# EasyEDA Pro project sucaiku.epro

# Schematic 01-MCU

## Sheets
1 01-MCU
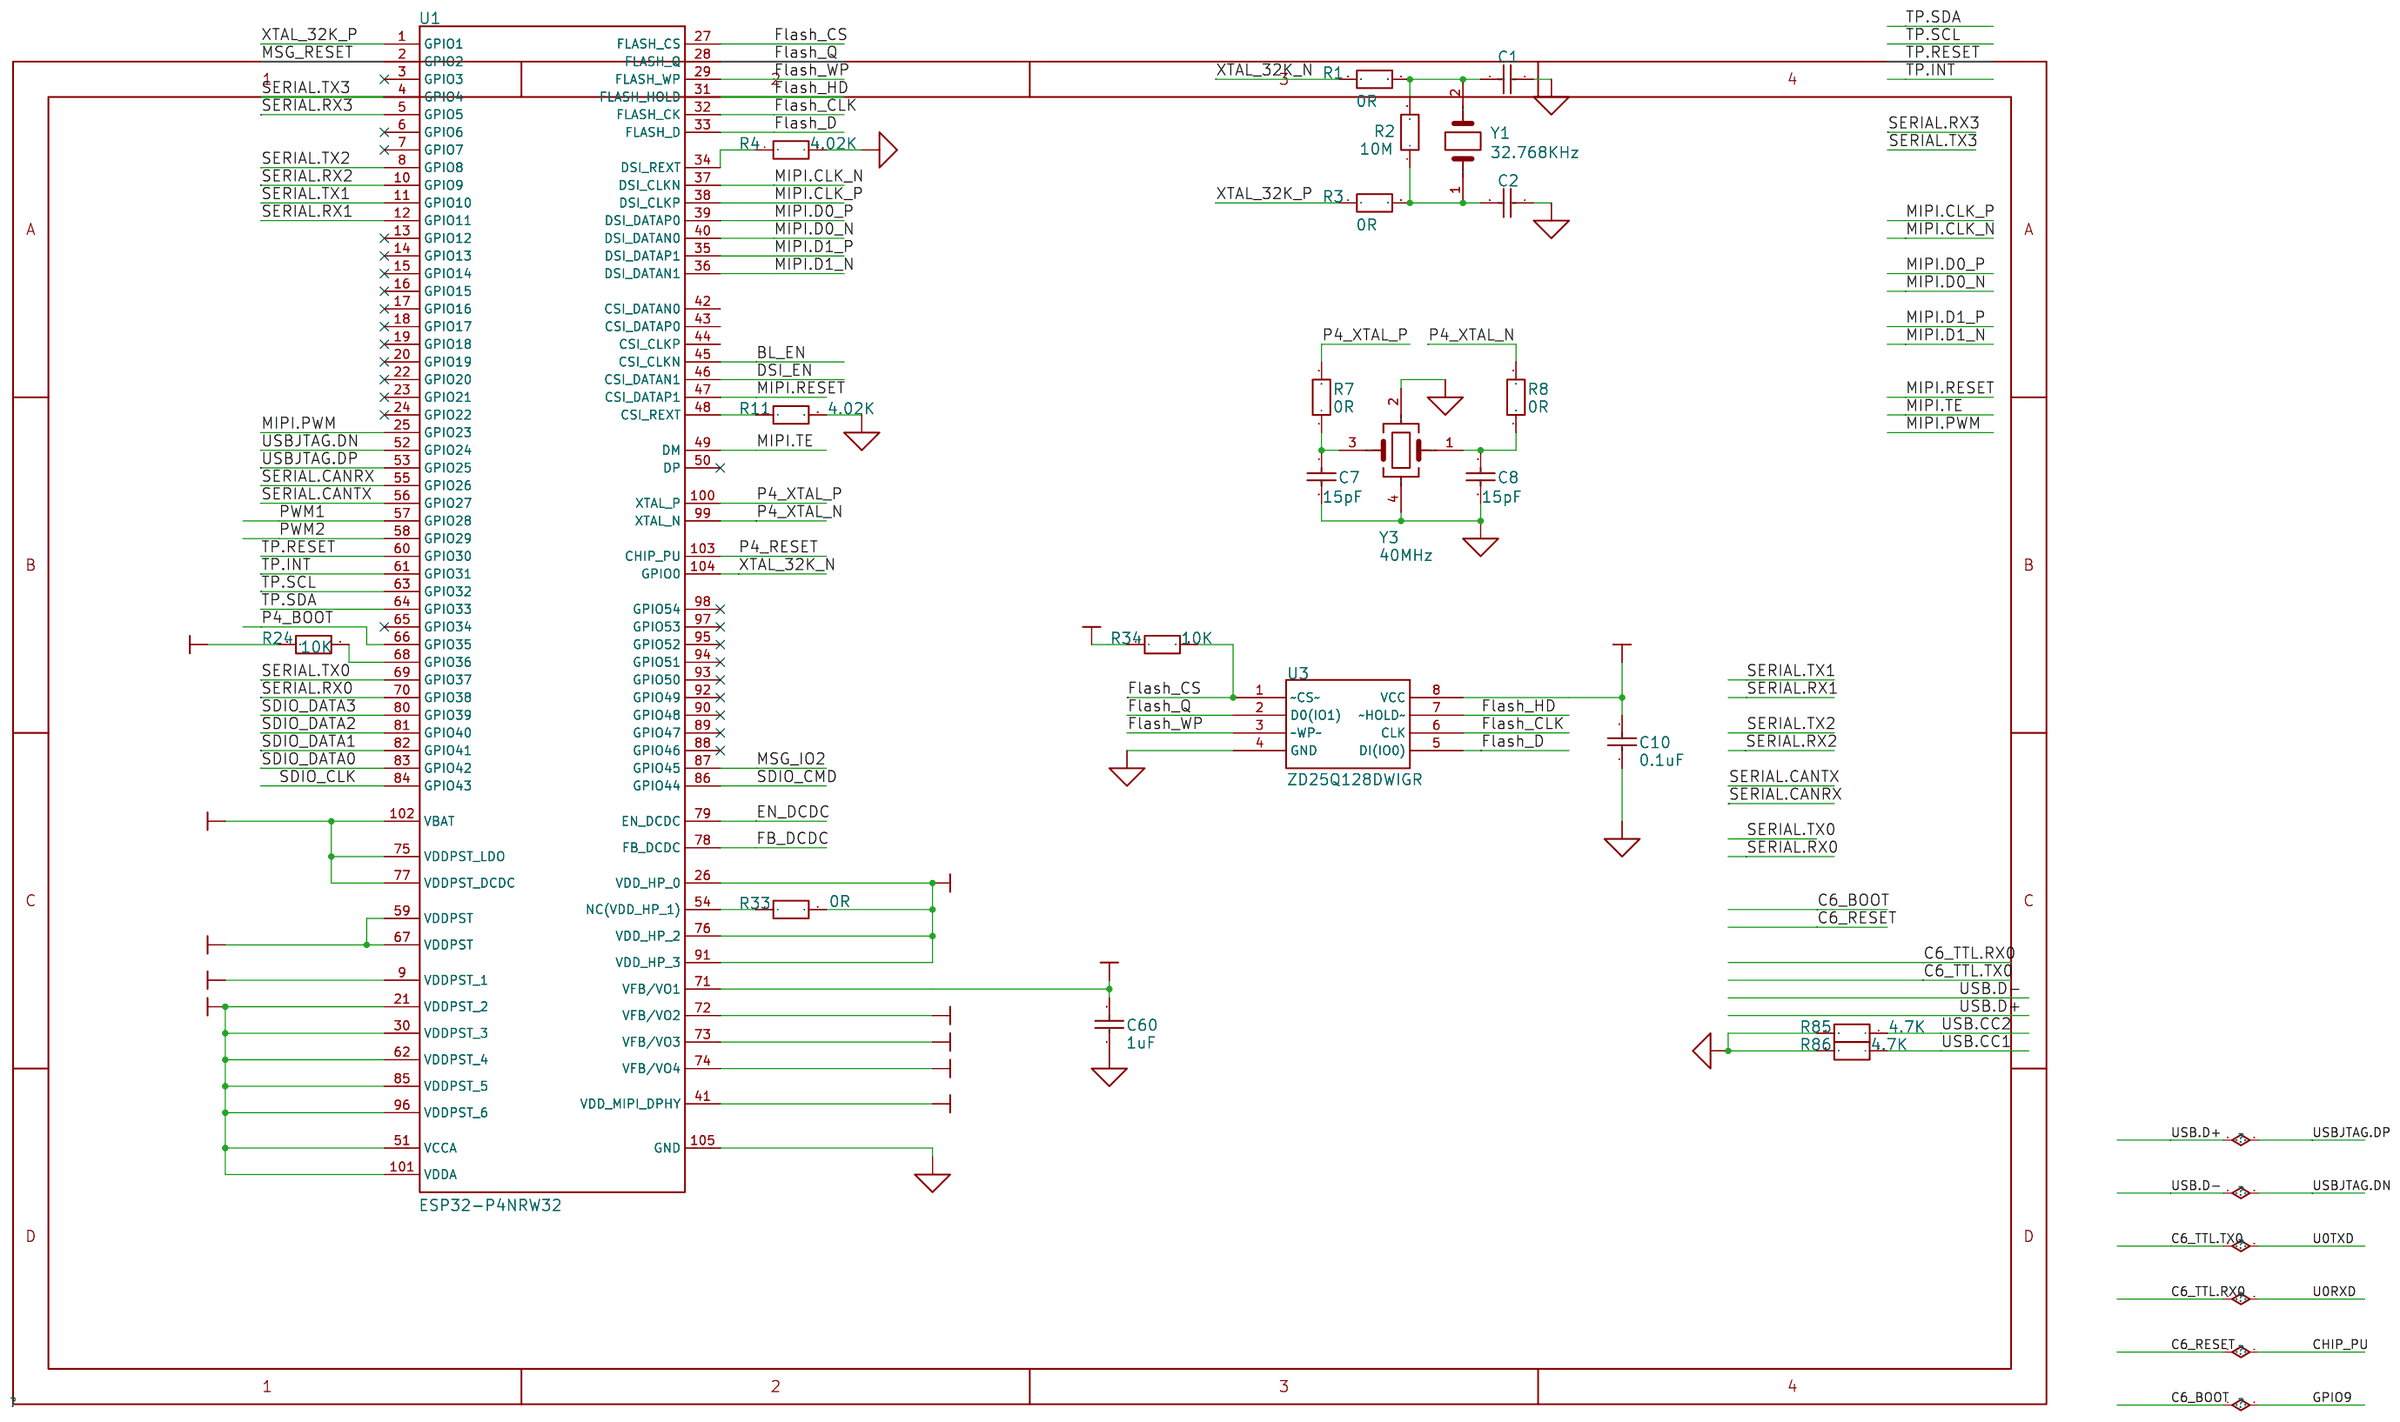
[diagram p0: 01-MCU]
2 02-WIFT+BT
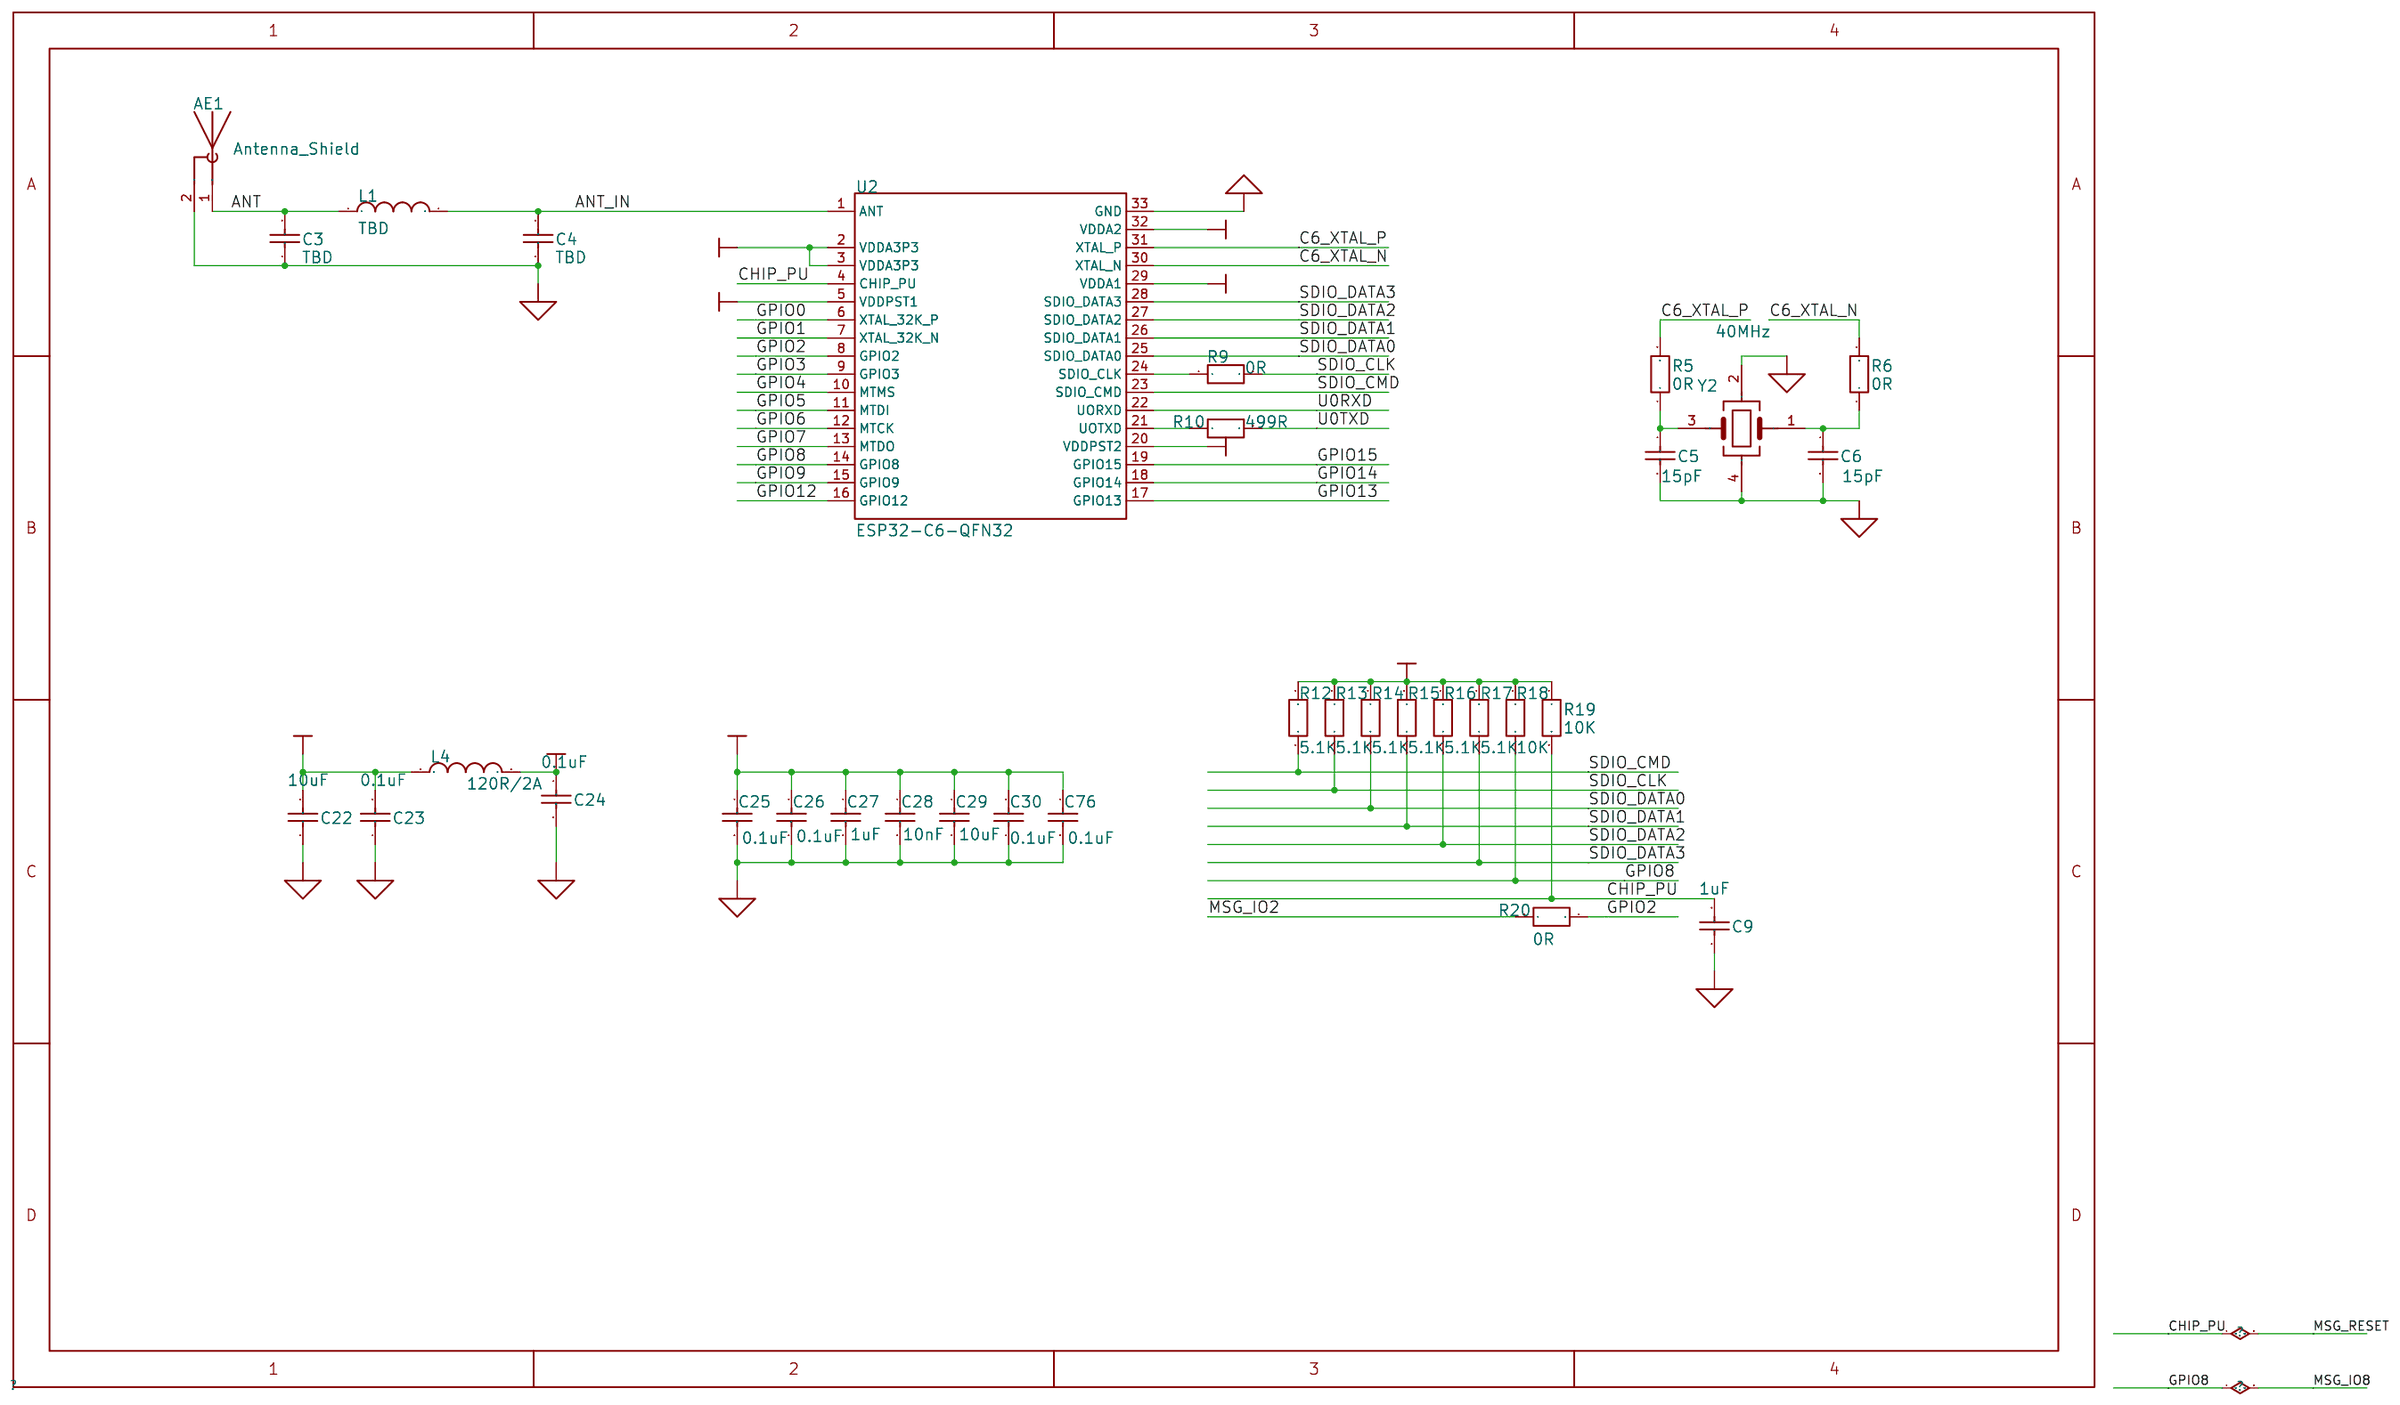
[diagram p1: 02-WIFT+BT]
3 03-POWER
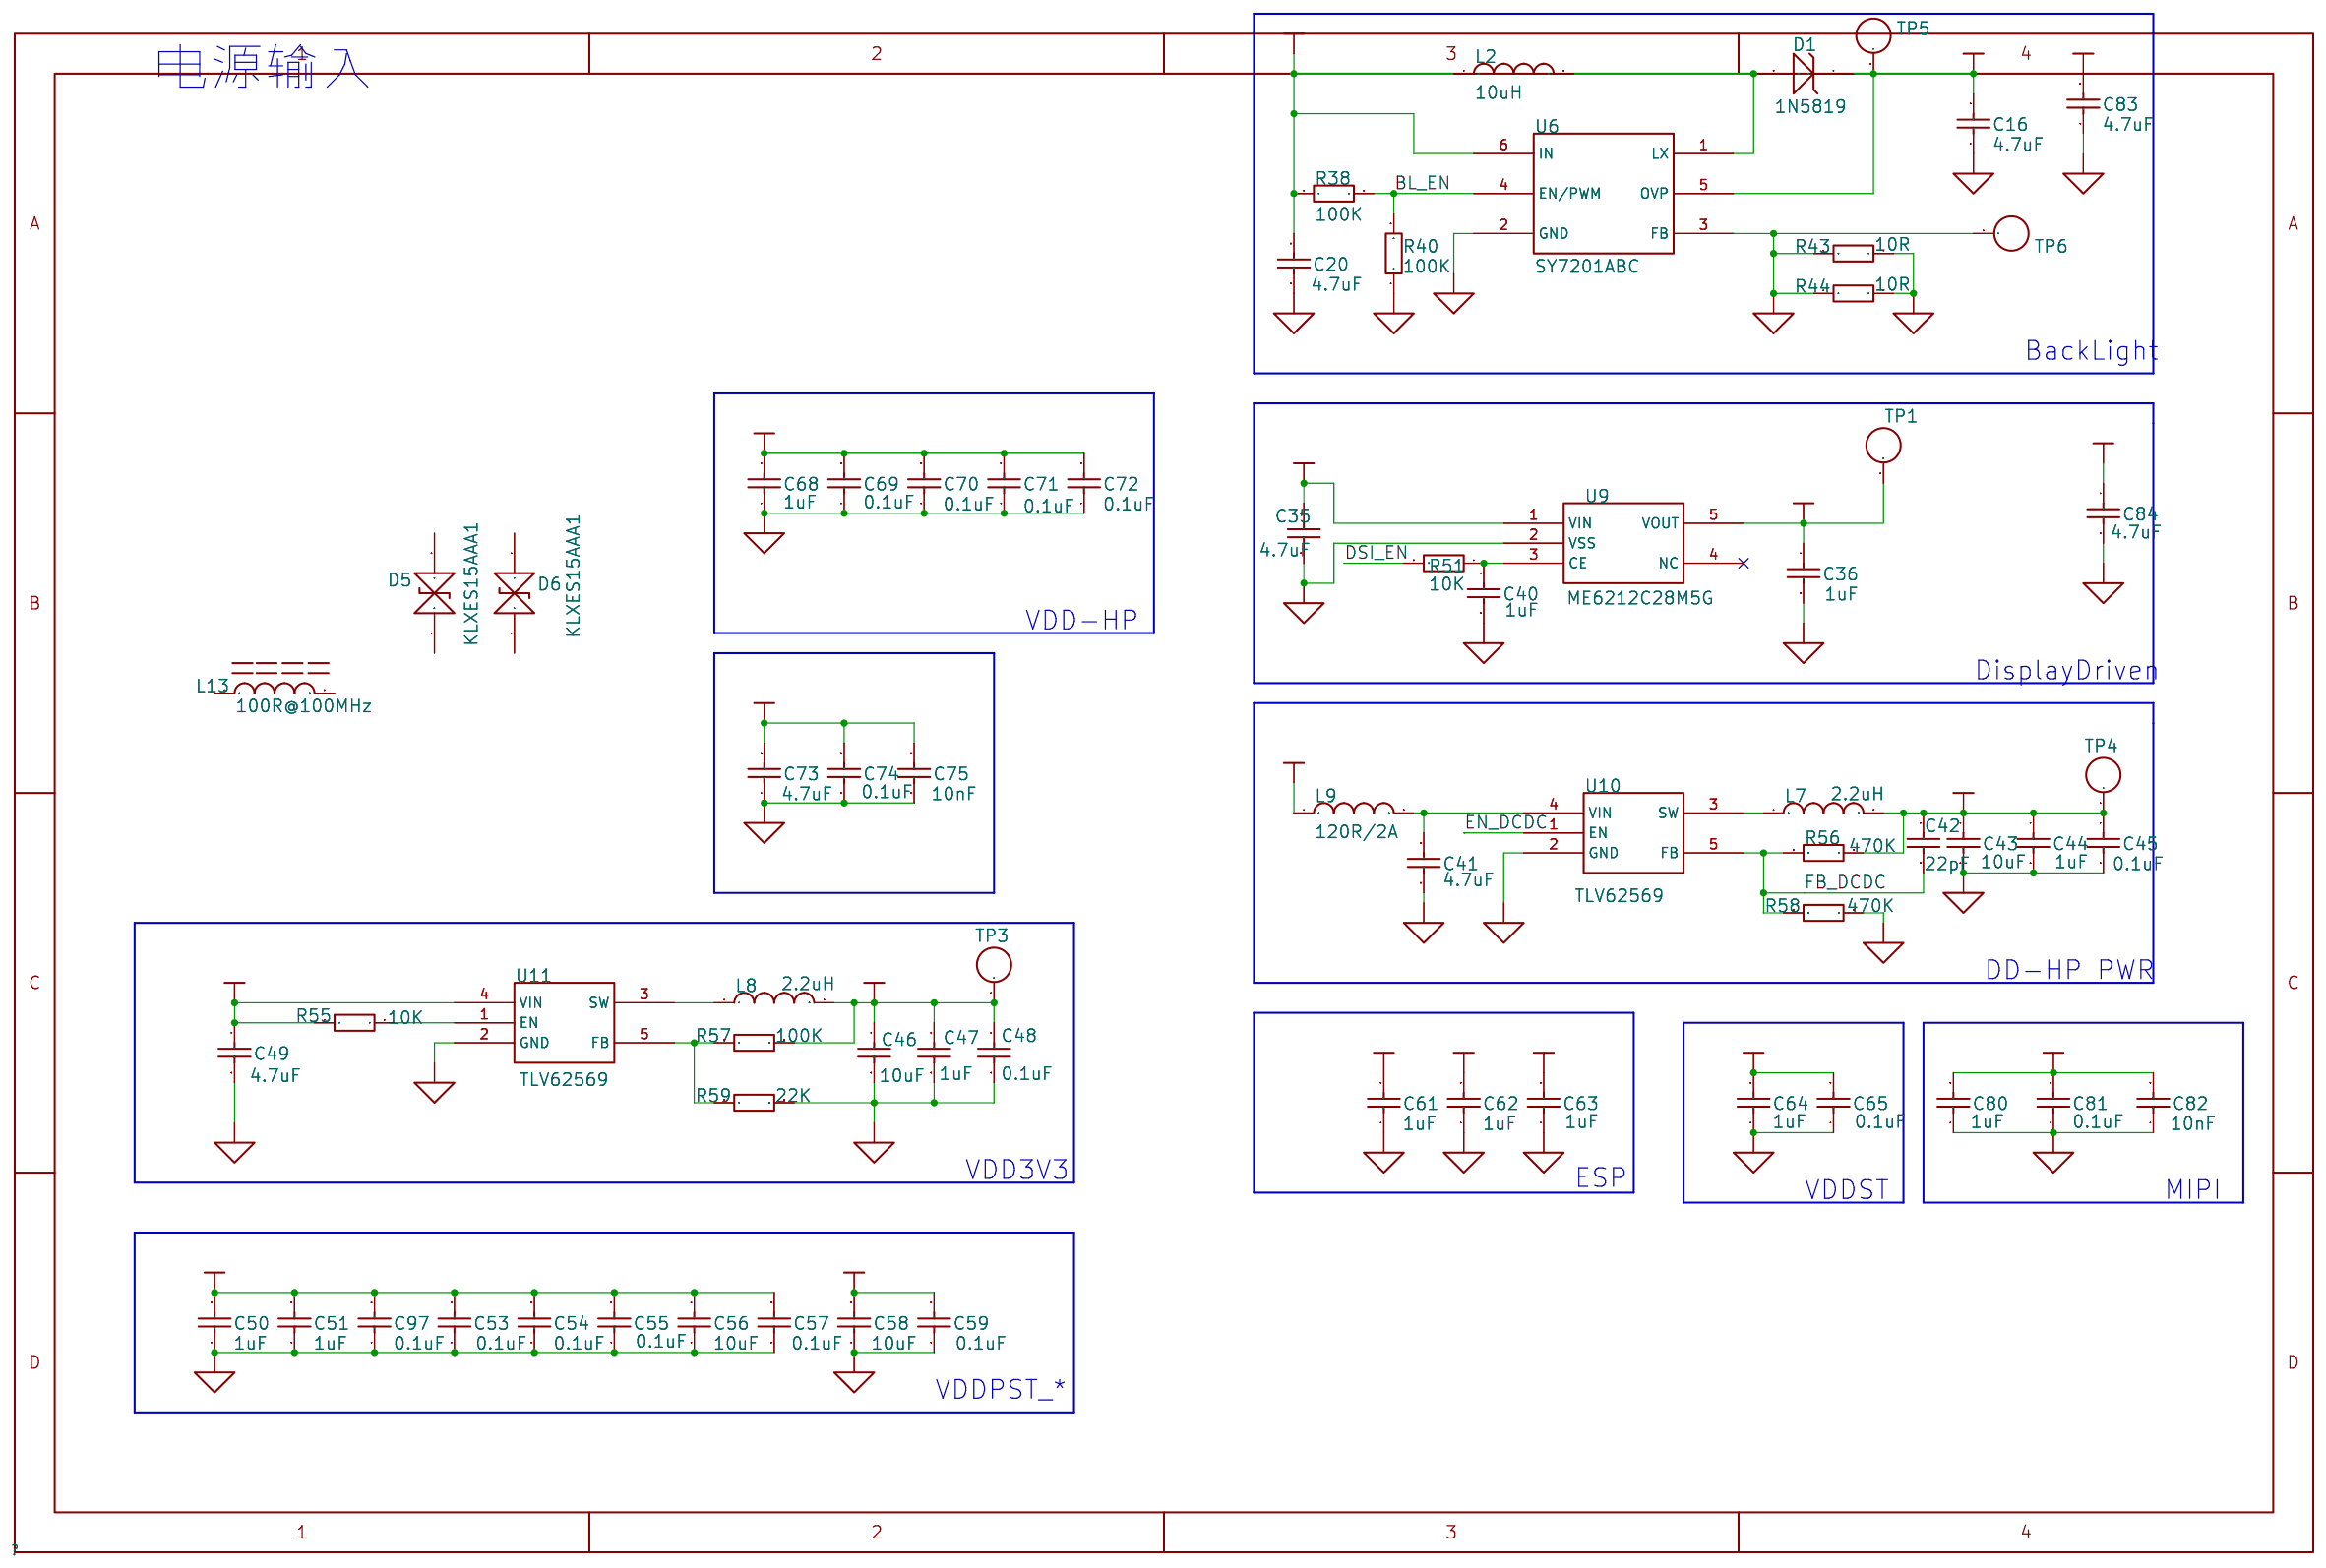
[diagram p2: 03-POWER]
4 04-RS485+CAN
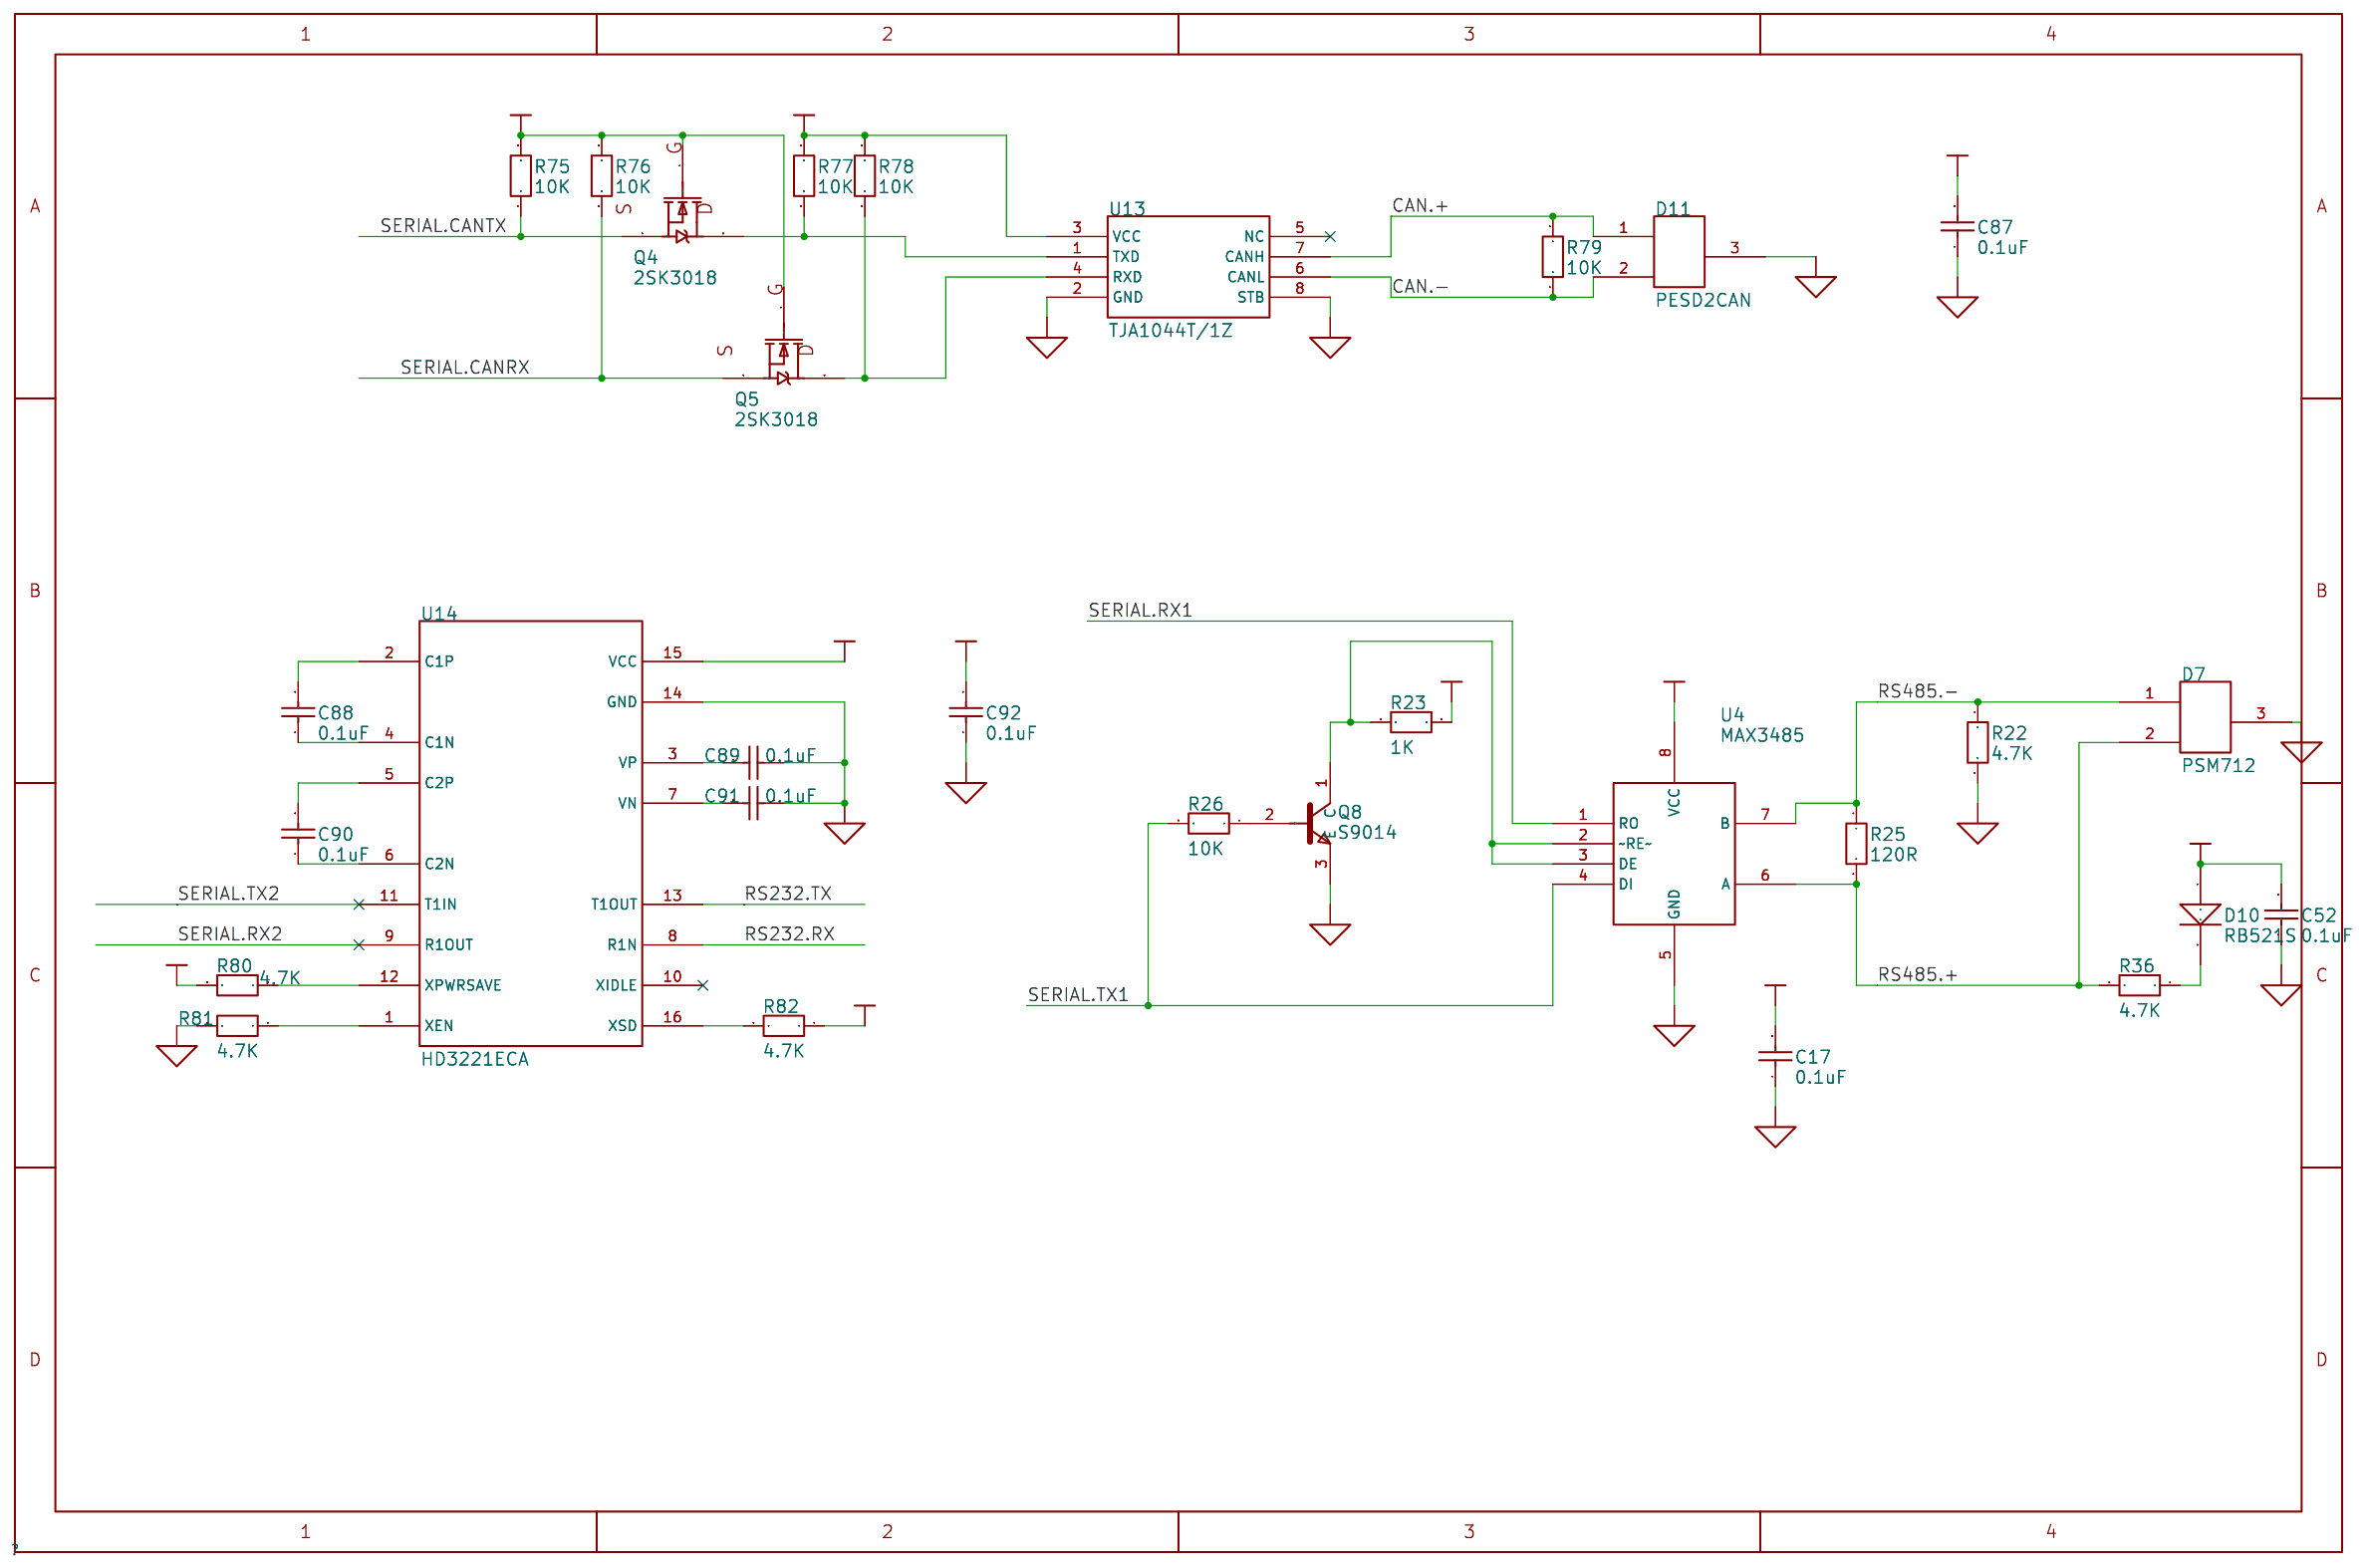
[diagram p3: 04-RS485+CAN]
5 05-Connector
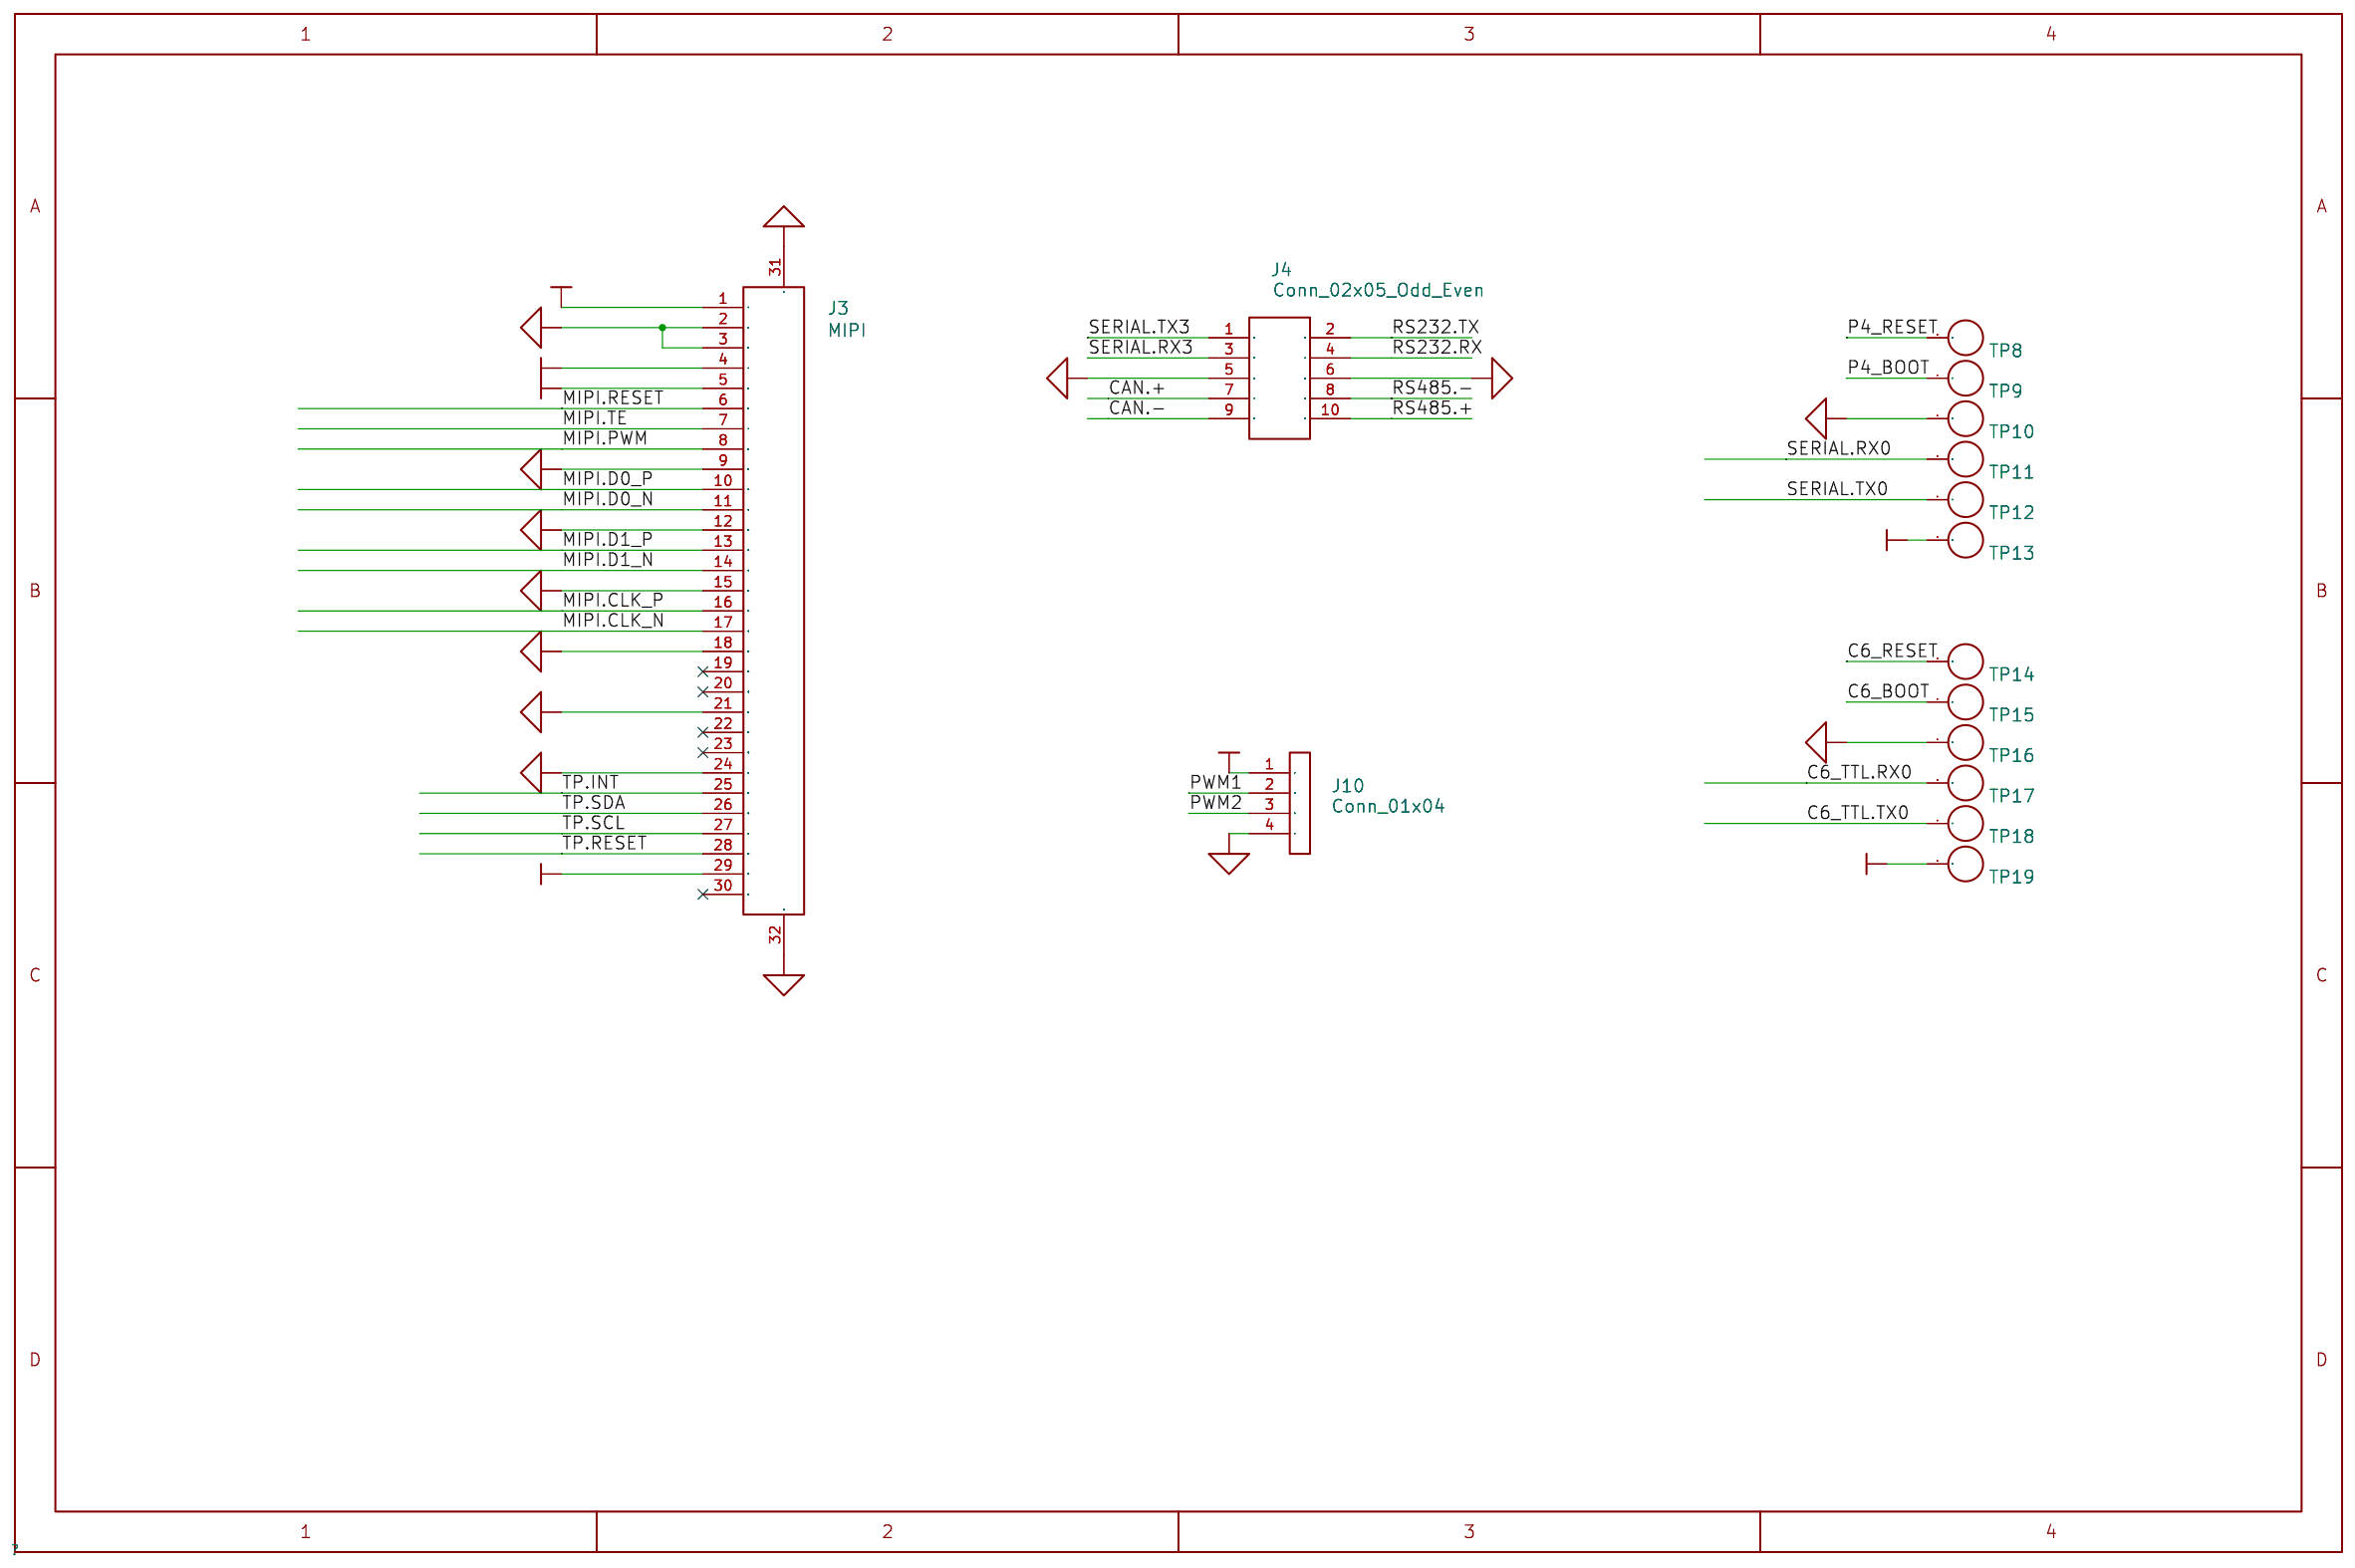
[diagram p4: 05-Connector]

## Parts
sheet 01-MCU
C1  12.5pF  [C0402]
C2  12.5pF  [C0402]
C7  15pF  [C0402]
C8  15pF  [C0402]
C10  0.1uF  [C0402]
C60  1uF  [C0402]
R1  0R  [R0402]
R2  10M  [R0402]
R3  0R  [R0402]
R4  4.02K  [R0402]
R7  0R  [R0402]
R8  0R  [R0402]
R11  4.02K  [R0402]
R24  10K  [R0402]
R33  0R  [R0402]
R34  10K  [R0402]
R85  4.7K  [R0402]
R86  4.7K  [R0402]
U1  ESP32-P4NRW32  [QFN-104_L10.0-W10.0-P0.35-TL-EP7.5]
U3  ZD25Q128DWIGR  [WSON-8_L6.0-W5.0-P1.27-BL-EP]
Y1  32.768KHz  [CRYSTAL-SMD_L3.2-W1.5-1]
Y3  40MHz  [OSC-SMD_4P-L3.2-W2.5-BL_SIT8008BI]
sheet 02-WIFT+BT
AE1  Antenna_Shield  [ANT]
C3  TBD  [C0402]
C4  TBD  [C0402]
C5  15pF  [C0402]
C6  15pF  [C0402]
C9  1uF  [C0402]
C22  10uF  [C0402]
C23  0.1uF  [C0402]
C24  0.1uF  [C0402]
C25  0.1uF  [C0402]
C26  0.1uF  [C0402]
C27  1uF  [C0402]
C28  10nF  [C0402]
C29  10uF  [C0402]
C30  0.1uF  [C0402]
C76  0.1uF  [C0402]
L1  TBD  [L0603]
L4  120R/2A  [L0603]
R5  0R  [R0402]
R6  0R  [R0402]
R9  0R  [R0402]
R10  499R  [R0402]
R12  5.1K  [R0402]
R13  5.1K  [R0402]
R14  5.1K  [R0402]
R15  5.1K  [R0402]
R16  5.1K  [R0402]
R17  5.1K  [R0402]
R18  10K  [R0402]
R19  10K  [R0402]
R20  0R  [R0402]
U2  ESP32-C6-QFN32
Y2  40MHz  [OSC-SMD_4P-L3.2-W2.5-BL_SIT8008BI]
sheet 03-POWER
C16  4.7uF  [C0402]
C20  4.7uF  [C0402]
C35  4.7uF  [C0402]
C36  1uF  [C0402]
C40  1uF  [C0402]
C41  4.7uF  [C0402]
C42  22pF  [C0402]
C43  10uF  [C0402]
C44  1uF  [C0402]
C45  0.1uF  [C0402]
C46  10uF  [C0402]
C47  1uF  [C0402]
C48  0.1uF  [C0402]
C49  4.7uF  [C0402]
C50  1uF  [C0402]
C51  1uF  [C0402]
C53  0.1uF  [C0402]
C54  0.1uF  [C0402]
C55  0.1uF  [C0402]
C56  10uF  [C0402]
C57  0.1uF  [C0402]
C58  10uF  [C0402]
C59  0.1uF  [C0402]
C61  1uF  [C0402]
C62  1uF  [C0402]
C63  1uF  [C0402]
C64  1uF  [C0402]
C65  0.1uF  [C0402]
C68  1uF  [C0402]
C69  0.1uF  [C0402]
C70  0.1uF  [C0402]
C71  0.1uF  [C0402]
C72  0.1uF  [C0402]
C73  4.7uF  [C0402]
C74  0.1uF  [C0402]
C75  10nF  [C0402]
C80  1uF  [C0402]
C81  0.1uF  [C0402]
C82  10nF  [C0402]
C83  4.7uF  [C0402]
C84  4.7uF  [C0402]
C97  0.1uF  [C0402]
D1  1N5819  [SOD-323_L1.8-W1.3-LS2.5-RD]
D5  KLXES15AAA1  [D0402-BI]
D6  KLXES15AAA1  [D0402-BI]
L2  10uH  [L0603]
L7  2.2uH  [L0603]
L8  2.2uH  [L0603]
L9  120R/2A  [L0603]
L13  100R  [LED0402-RD]
R38  NC  [R0402]
R40  NC  [R0402]
R43  10R  [R0402]
R44  10R  [R0402]
R51  10K  [R0402]
R55  10K  [R0402]
R56  470K  [R0402]
R57  100K  [R0402]
R58  470K  [R0402]
R59  22K  [R0402]
TP1  TP13  [Test-Point-1*1mm]
TP3  TP13  [Test-Point-1*1mm]
TP4  TP13  [Test-Point-1*1mm]
TP5  TP13  [Test-Point-1*1mm]
TP6  TP13  [Test-Point-1*1mm]
U6  SY7201ABC  [SOT-23-6_L2.9-W1.6-P0.95-LS2.8-BL]
U9  ME6212C28M5G  [SOT-23-5_L3.0-W1.7-P0.95-LS2.8-BR]
U10  TLV62569  [SOT-23-5_L3.0-W1.7-P0.95-LS2.8-BR]
U11  TLV62569  [SOT-23-5_L3.0-W1.7-P0.95-LS2.8-BR]
sheet 04-RS485+CAN
C17  0.1uF  [C0402]
C52  0.1uF  [C0402]
C87  0.1uF  [C0402]
C88  0.1uF  [C0402]
C89  0.1uF  [C0402]
C90  0.1uF  [C0402]
C91  0.1uF  [C0402]
C92  0.1uF  [C0402]
D7  PSM712  [SOT-23-3_L3.0-W1.7-P0.95-LS2.9-BR]
D10  RB521S  [SOD-523_L1.2-W0.8-LS1.6-RD]
D11  PESD2CAN  [SOT-23-3_L3.0-W1.7-P0.95-LS2.9-BR]
Q4  2SK3018  [SOT-23-3_L2.9-W1.6-P1.90-LS2.8-BR]
Q5  2SK3018  [SOT-23-3_L2.9-W1.6-P1.90-LS2.8-BR]
Q8  S9014  [SOT-23-3_L2.9-W1.6-P1.90-LS2.8-BR]
R22  4.7K  [R0402]
R23  1K  [R0402]
R25  120R  [R0402]
R26  10K  [R0402]
R36  4.7K  [R0402]
R75  10K  [R0402]
R76  10K  [R0402]
R77  10K  [R0402]
R78  10K  [R0402]
R79  10K  [R0402]
R80  4.7K  [R0402]
R81  4.7K  [R0402]
R82  4.7K  [R0402]
U4  MAX3485  [SOIC-8_L4.9-W3.9-P1.27-LS6.0-BL]
U13  TJA1044T/1Z  [SOIC-8_L4.9-W3.9-P1.27-LS6.0-BL]
U14  HD3221ECA  [SSOP-16_L6.2-W5.3-P0.65-LS7.8-BL]
sheet 05-Connector
J3  MIPI  [FPC-SMD_30P-P0.50_XUNPU_FPC-05F-30PH20]
J4  Conn_02x05_Odd_Even  [HDR-TH_10P-P2.54-H-M-R2-C5-S2.54-N]
J10  Conn_01x04  [HDR-TH_4P-P2.54-H-M-W10.4]
TP8  TP8  [Test-Point-1*1mm]
TP9  TP9  [Test-Point-1*1mm]
TP10  TP10  [Test-Point-1*1mm]
TP11  TP11  [Test-Point-1*1mm]
TP12  TP12  [Test-Point-1*1mm]
TP13  TP13  [Test-Point-1*1mm]
TP14  TP14  [Test-Point-1*1mm]
TP15  TP15  [Test-Point-1*1mm]
TP16  TP16  [Test-Point-1*1mm]
TP17  TP17  [Test-Point-1*1mm]
TP18  TP18  [Test-Point-1*1mm]
TP19  TP19  [Test-Point-1*1mm]

## Library data of the parts
C1-C10 C16 C20 C22-C30 C35 C36 C40-C51 C53-C65 C68-C76 C80-C84 C97 = Capacitor: SimulationGenericComponent: True; LibraryName: Simulation Generic Components
R1-R20 R22-R26 R33 R36 R75-R82 R85 R86 = R: LibraryName: PCB_Project
R34 = R?: LibraryName: Schlib1
U1 = ESP32-P4NRW32: LibraryName: PCB_Project_1
U3 = ZD25Q128DWIGR: LibraryName: Schlib1
Y1 = Component_2: LibraryName: 222222
Y2 Y3 = Component_3: LibraryName: 222222
AE1 = Component_1: LibraryName: 222222
L1 L2 L4 L7-L9 = Inductor: SimulationGenericComponent: True; LibraryName: Simulation Generic Components
U2 = ESP32-C6-QFN32: LibraryName: 222222
D1 = Suppressor Single: AF: 1; BV: 0; BV_MAX: 1e99; CJO: 0; CJP: 0; CTA: 0; CTP: 0; EG: 1.11; FC: 0.5; FCS: 0.5; FV_MAX: 1e99; IBV: 0.001; IKF: 0; IKR: 0; IS: 1e-14; ISR: 1e-14; JSW: 0; JTUN: 0; JTUNSW: 0; KEG: 1; KF: 0; LEVEL: 1; MJSW: 0.33; N: 1; NBV: 1; NR: 1; NS: 1; NTUN: 30; PHP: 1; RS: 0; TCV: 0; TLEV: 0; TLEVC: 0; TM1: 0; TM2: 0; TNOM: 27; TPB: 0; TPHP: 0; TRS: 0; TRS2: 0; TT: 0; TTT1: 0; TTT2: 0; VJ: 1; XTI: 3; XTITUN: 3; SimulationGenericComponent: True; LibraryName: Simulation Generic Components
D5 D6 = KLXES15AAA1: LibraryName: Schlib1
L13 = Inductor_1: Inductor; SimulationGenericComponent: True; DesignItemID: Inductor; LibraryName: PCB_Project
R38 R43 R44 R51 R55-R59 = Res2: Resistor; Published: 8-Jun-2000; LatestRevisionDate: 17-Jul-2002; LatestRevisionNote: Re-released for DXP Platform.; PackageReference: AXIAL-0.4; Publisher: Altium Limited; PackageDescription: Axial Device, Thru-Hole; 2 Leads; 0.4 in Pin Spacing; LibraryName: Miscellaneous Devices
R40 = Res2_1: Resistor; Published: 8-Jun-2000; LatestRevisionDate: 17-Jul-2002; LatestRevisionNote: Re-released for DXP Platform.; PackageReference: AXIAL-0.4; Publisher: Altium Limited; PackageDescription: Axial Device, Thru-Hole; 2 Leads; 0.4 in Pin Spacing; DesignItemID: Res2; LibraryName: Miscellaneous Devices
TP1 TP3-TP6 TP8-TP19 = TP?: LibraryName: Schlib1
U6 = SY7201ABC: LibraryName: Schlib1
U9 = ME6212C28M5G: LibraryName: Schlib1
U10 U11 = TLV62569: LibraryName: Schlib1
C17 C52 C87-C92 = CAP1: LibraryName: PCB_Project
D7 D11 = PESD2CAN: LibraryName: Schlib1
D10 = DIODE: LibraryName: PCB_Project
Q4 Q5 = 2N7002: LibraryName: PCB_Project
Q8 = NPN: LibraryName: PCB_Project
U4 = MAX3485: LibraryName: Schlib1
U13 = TJA1044T/1Z: LibraryName: Schlib1
U14 = HD3221ECA: LibraryName: Sheet2
J3 = MIPI: LibraryName: PCB_Project
J4 = Conn_02x05_Odd_Even: LibraryName: Schlib1
J10 = Conn_01x04: LibraryName: Schlib1

## Nets
GND: AE1.2 C1.1 C2.1 C3.1 C4.1 C5.2 C6.2 C7.2 C8.2 C9.1 C10.1 C16.1 C17.1 C20.1 C22.1 C23.1 C24.2 C25.2 C26.2 C27.2 C28.2 C29.2 C30.1 C35.2 C36.2 C40.2 C41.2 C43.2 C44.2 C45.2 C46.2 C47.2 C48.2 C49.2 C50.1 C51.1 C52.1 C53.1 C54.1 C55.1 C56.1 C57.1 C58.1 C59.1 C60.1 C61.1 C62.1 C63.1 C64.1 C65.1 C68.1 C69.1 C70.1 C71.1 C72.1 C73.1 C74.1 C75.1 C76.2 C80.1 C81.1 C82.1 C84.2 C87.1 C89.1 C91.1 C92.1 C97.1 D7.3 D11.3 J3.9 J3.12 J3.15 J3.18 J3.21 J3.24 J3.31 J3.32 J4.5 J4.6 J10.4 Q8.3(E) R4.2 R11.2 R22.2 R40.1 R43.1 R44.1 R58.2 R59.2 R81.2 R85.2 R86.2 TP10.1 TP16.1 U1.105(GND) U2.33(GND) U3.4(GND) U4.5(GND) U6.2(GND) U9.2(VSS) U10.2(GND) U11.2(GND) U13.2(GND) U13.8(STB) U14.14(GND) Y2.2 Y2.4 Y3.2 Y3.4
VCC-5V: C20.2 C35.1 C49.1 C87.2 L2.1 R38.1 R55.1 R77.2 R78.2 U6.6(IN) U9.1(VIN) U11.4(VIN) U13.3(VCC)
VCC-LEDA: C16.2 C83.2 D1.1(K) J3.1 TP5.1 U6.5(OVP)
VDD-2V8: C36.1 C84.1 J3.4 TP1.1 U9.5(VOUT)
VDD-3V3: C10.2 C17.2 C22.2 C23.2 C46.1 C47.1 C48.1 C50.2 C51.2 C52.2 C53.2 C54.2 C55.2 C56.2 C57.2 C60.2 C73.2 C74.2 C75.2 C92.2 C97.2 D10.1(A) J3.29 L4.1 L8.2 L9.1 Q4.1(G) Q5.1(G) R12.1 R13.1 R14.1 R15.1 R16.1 R17.1 R18.1 R19.1 R23.1 R24.1 R34.1 R57.2 R75.2 R76.2 R80.2 R82.1 TP3.1 TP13.1 TP19.1 U1.21(VDDPST_2) U1.30(VDDPST_3) U1.51(VCCA) U1.62(VDDPST_4) U1.71(VFB/VO1) U1.75(VDDPST_LDO) U1.77(VDDPST_DCDC) U1.85(VDDPST_5) U1.96(VDDPST_6) U1.101(VDDA) U1.102(VBAT) U3.8(VCC) U4.8(VCC) U14.15(VCC)
VDD-C6: C24.1 C25.1 C26.1 C27.1 C28.1 C29.1 C30.2 C76.1 L4.2 U2.2(VDDA3P3) U2.3(VDDA3P3) U2.5(VDDPST1) U2.20(VDDPST2) U2.29(VDDA1) U2.32(VDDA2)
VDD-HP: C42.1 C43.1 C44.1 C45.1 C68.2 C69.2 C70.2 C71.2 C72.2 L7.2 R33.2 R56.2 TP4.1 U1.26(VDD_HP_0) U1.76(VDD_HP_2) U1.91(VDD_HP_3)
ANT: AE1.1 C3.2 L1.1
ANT_IN: C4.2 L1.2 U2.1(ANT)
BL_EN: R38.2 R40.2 U1.45(CSI_CLKN) U6.4(EN/PWM)
C6_BOOT: TP15.1 U2.15(GPIO9)
C6_RESET: C9.2 R19.2 TP14.1 U1.2(GPIO2) U2.4(CHIP_PU)
C6_TTL.RX0: TP17.1 U2.22(UORXD)
C6_TTL.TX0: R10.2 TP18.1
C6_XTAL_N: R6.2 U2.30(XTAL_N)
C6_XTAL_P: R5.2 U2.31(XTAL_P)
CAN.+: D11.1 J4.7 R79.2 U13.7(CANH)
CAN.-: D11.2 J4.9 R79.1 U13.6(CANL)
DSI_EN: R51.2 U1.46(CSI_DATAN1)
EN_DCDC: U1.79(EN_DCDC) U10.1(EN)
ESP-V02: C61.2 C64.2 C65.2 U1.59(VDDPST) U1.67(VDDPST) U1.72(VFB/VO2)
ESP-V03: C62.2 C80.2 C81.2 C82.2 J3.5 U1.41(VDD_MIPI_DPHY) U1.73(VFB/VO3)
ESP-V04: C58.2 C59.2 C63.2 U1.9(VDDPST_1) U1.74(VFB/VO4)
FB_DCDC: C42.2 R56.1 R58.1 U1.78(FB_DCDC) U10.5(FB)
Flash_CLK: U1.32(FLASH_CK) U3.6(CLK)
Flash_CS: R34.2 U1.27(FLASH_CS) U3.1(~CS~)
Flash_D: U1.33(FLASH_D) U3.5(DI(IO0))
Flash_HD: U1.31(FLASH_HOLD) U3.7(~HOLD~)
Flash_Q: U1.28(FLASH_Q) U3.2(D0(IO1))
Flash_WP: U1.29(FLASH_WP) U3.3(~WP~)
GPIO0: U2.6(XTAL_32K_P)
GPIO1: U2.7(XTAL_32K_N)
GPIO2: R20.2 U2.8(GPIO2)
GPIO3: U2.9(GPIO3)
GPIO4: U2.10(MTMS)
GPIO5: U2.11(MTDI)
GPIO6: U2.12(MTCK)
GPIO7: U2.13(MTDO)
GPIO8: R18.2 U2.14(GPIO8)
GPIO12: U2.16(GPIO12)
GPIO13: U2.17(GPIO13)
GPIO14: U2.18(GPIO14)
GPIO15: U2.19(GPIO15)
LEDK: C83.1 J3.2 J3.3 R43.2 R44.2 TP6.1 U6.3(FB)
MIPI.CLK_N: J3.17 U1.37(DSI_CLKN)
MIPI.CLK_P: J3.16 U1.38(DSI_CLKP)
MIPI.D0_N: J3.11 U1.40(DSI_DATAN0)
MIPI.D0_P: J3.10 U1.39(DSI_DATAP0)
MIPI.D1_N: J3.14 U1.36(DSI_DATAN1)
MIPI.D1_P: J3.13 U1.35(DSI_DATAP1)
MIPI.PWM: J3.8 U1.25(GPIO23)
MIPI.RESET: J3.6 U1.47(CSI_DATAP1)
MIPI.TE: J3.7 U1.49(DM)
MSG_IO2: R20.1 U1.87(GPIO45)
P4_BOOT: TP9.1 U1.66(GPIO35)
P4_RESET: TP8.1 U1.103(CHIP_PU)
P4_XTAL_N: R8.2 U1.99(XTAL_N)
P4_XTAL_P: R7.2 U1.100(XTAL_P)
PWM1: J10.2 U1.57(GPIO28)
PWM2: J10.3 U1.58(GPIO29)
RS232.RX: J4.4 U14.8(R1N)
RS232.TX: J4.2 U14.13(T1OUT)
RS485.+: D7.2 J4.10 R25.2 R36.2 U4.6(A)
RS485.-: D7.1 J4.8 R22.1 R25.1 U4.7(B)
SDIO_CLK: R9.2 R13.2 U1.84(GPIO43)
SDIO_CMD: R12.2 U1.86(GPIO44) U2.23(SDIO_CMD)
SDIO_DATA0: R14.2 U1.83(GPIO42) U2.25(SDIO_DATA0)
SDIO_DATA1: R15.2 U1.82(GPIO41) U2.26(SDIO_DATA1)
SDIO_DATA2: R16.2 U1.81(GPIO40) U2.27(SDIO_DATA2)
SDIO_DATA3: R17.2 U1.80(GPIO39) U2.28(SDIO_DATA3)
SERIAL.CANRX: Q5.2(S) R76.1 U1.55(GPIO26)
SERIAL.CANTX: Q4.2(S) R75.1 U1.56(GPIO27)
SERIAL.RX0: TP11.1 U1.70(GPIO38)
SERIAL.RX1: U1.12(GPIO11) U4.1(RO)
SERIAL.RX2: U1.10(GPIO9) U14.9(R1OUT)
SERIAL.RX3: J4.3 U1.5(GPIO5)
SERIAL.TX0: TP12.1 U1.69(GPIO37)
SERIAL.TX1: R26.2 U1.11(GPIO10) U4.4(DI)
SERIAL.TX2: U1.8(GPIO8) U14.11(T1IN)
SERIAL.TX3: J4.1 U1.4(GPIO4)
TP.INT: J3.25 U1.61(GPIO31)
TP.RESET: J3.28 U1.60(GPIO30)
TP.SCL: J3.27 U1.63(GPIO32)
TP.SDA: J3.26 U1.64(GPIO33)
USB.CC1: R86.1
USB.CC2: R85.1
USB.D+: U1.53(GPIO25)
USB.D-: U1.52(GPIO24)
USB_5V0: J10.1
XTAL_32K_N: R1.1 U1.104(GPIO0)
XTAL_32K_P: R3.1 U1.1(GPIO1)
Net-(R9-1): R9.1 U2.24(SDIO_CLK)
Net-(R10-1): R10.1 U2.21(UOTXD)
NetC1_2: C1.2 R1.2 R2.2 Y1.2
NetC2_2: C2.2 R2.1 R3.2 Y1.1
NetC5_1: C5.1 R5.1 Y2.3
NetC6_1: C6.1 R6.1 Y2.1
NetC7_1: C7.1 R7.1 Y3.3
NetC8_1: C8.1 R8.1 Y3.1
NetC40_1: C40.1 R51.1 U9.3(CE)
NetC41_1: C41.1 L9.2 U10.4(VIN)
NetC88_1: C88.1 U14.4(C1N)
NetC88_2: C88.2 U14.2(C1P)
NetC89_2: C89.2 U14.3(VP)
NetC90_1: C90.1 U14.6(C2N)
NetC90_2: C90.2 U14.5(C2P)
NetC91_2: C91.2 U14.7(VN)
NetD1_2: D1.2(A) L2.2 U6.1(LX)
NetD10_2: D10.2(K) R36.1
NetL7_1: L7.1 U10.3(SW)
NetL8_1: L8.1 U11.3(SW)
NetQ4_3: Q4.3(D) R77.1 U13.1(TXD)
NetQ5_3: Q5.3(D) R78.1 U13.4(RXD)
NetQ8_1: Q8.1(C) R23.2 U4.2(~RE~) U4.3(DE)
NetQ8_2: Q8.2(B) R26.1
NetR4_1: R4.1 U1.34(DSI_REXT)
NetR11_1: R11.1 U1.48(CSI_REXT)
NetR24_2: R24.2 U1.68(GPIO36)
NetR33_1: R33.1 U1.54(NC(VDD_HP_1))
NetR55_2: R55.2 U11.1(EN)
NetR57_1: R57.1 R59.1 U11.5(FB)
NetR80_1: R80.1 U14.12(XPWRSAVE)
NetR81_1: R81.1 U14.1(XEN)
NetR82_2: R82.2 U14.16(XSD)

Not connected (* = marked no-connect by the designer): D5 1 2; D6 1 2; J3 19* 20* 22* 23* 30*; L13 1 2; U1 3(GPIO3)* 6(GPIO6)* 7(GPIO7)* 13(GPIO12)* 14(GPIO13)* 15(GPIO14)* 16(GPIO15)* 17(GPIO16)* 18(GPIO17)* 19(GPIO18)* 20(GPIO19)* 22(GPIO20)* 23(GPIO21)* 24(GPIO22)* 42(CSI_DATAN0) 43(CSI_DATAP0) 44(CSI_CLKP) 50(DP)* 65(GPIO34)* 88(GPIO46)* 89(GPIO47)* 90(GPIO48)* 92(GPIO49)* 93(GPIO50)* 94(GPIO51)* 95(GPIO52)* 97(GPIO53)* 98(GPIO54)*; U9 4(NC)*; U13 5(NC)*; U14 10(XIDLE)*

## Notes on the sheets
sheet 3
- 电源输入
- BackLight
- VDD-HP
- DisplayDriven
- DD-HP PWR
- VDD3V3
- ESP
- VDDST
- MIPI
- VDDPST_*

# Board PCB1
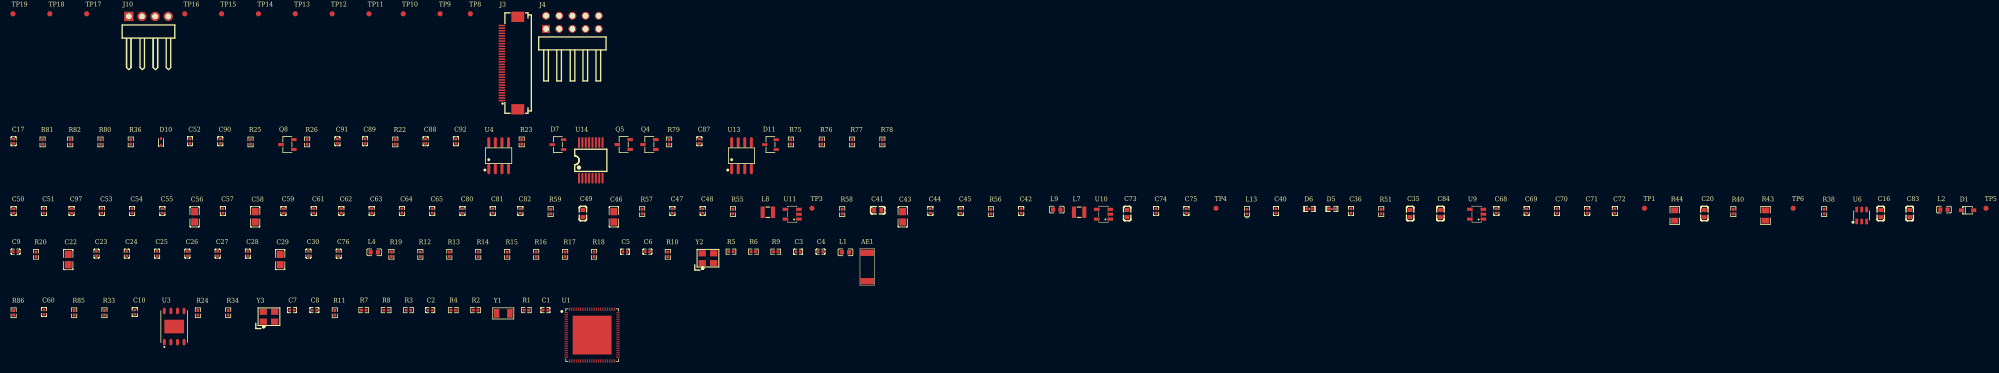
[diagram p5: board, top side]
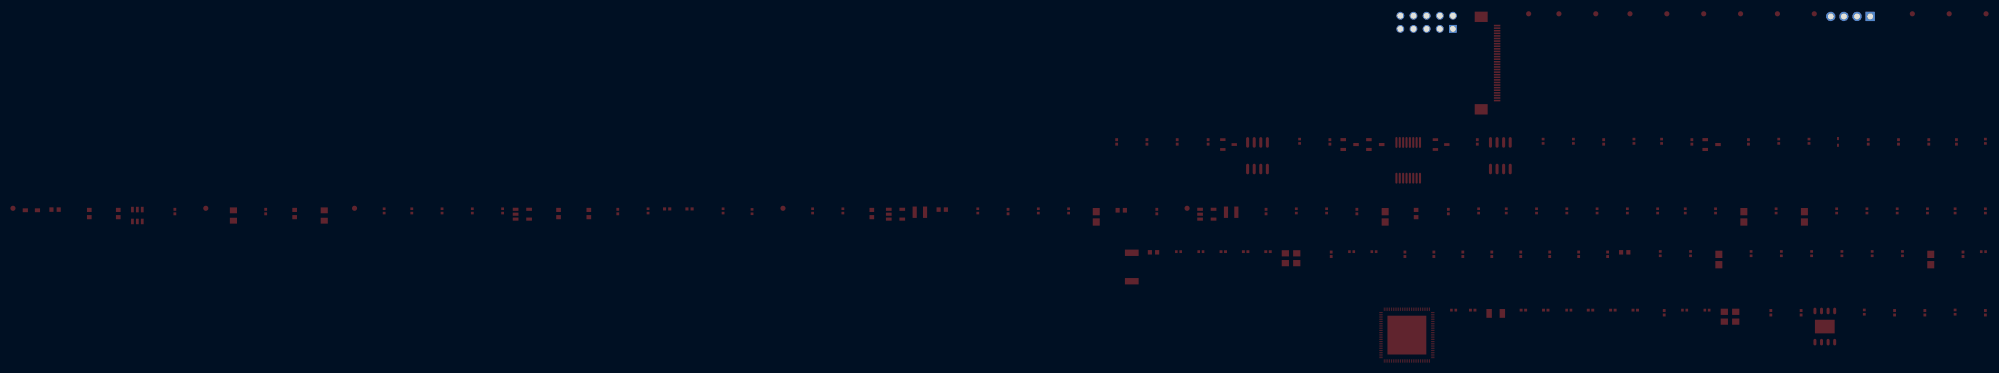
[diagram p6: board, bottom side, seen from below]

No outline. copper layers: Top Layer, Mid-Layer 1, Internal Plane 1, Mid-Layer 2, Internal Plane 2, Mid-Layer 3, Internal Plane 3, Mid-Layer 4, Internal Plane 4, Mid-Layer 5, Internal Plane 5, Mid-Layer 6, Internal Plane 6, Mid-Layer 7, Internal Plane 7, Mid-Layer 8, Internal Plane 8, Mid-Layer 9, Internal Plane 9, Mid-Layer 10, Internal Plane 10, Mid-Layer 11, Internal Plane 11, Mid-Layer 12, Internal Plane 12, Mid-Layer 13, Internal Plane 13, Mid-Layer 14, Internal Plane 14, Mid-Layer 15, Internal Plane 15, Bottom Layer. Coordinates in mm from the lowest, leftmost part position.
Stack: Top Layer 0.0356mm / Dielectric 1 0.32mm FR-4 er 4.8 / Bottom Layer 0.0356mm

## Design rules (mm)
spacing Clearance (default): track to track 0.254, other pairs 0 to 0.3
spacing Plane_PlaneConnect: track to track 0.254, other pairs 0 to 0.3
spacing Copper_PolygonConnect: track to track 0.254, other pairs 0 to 0.3
track width Width (default): min 0.254, default 0.254, max 0.254
differential pair DiffPairsRouting (default): width min 0.381, default 0.381, max 0.381; gap min 0.254, default 0.254

## Placement (name value [footprint] x y rotation side)
AE1  Antenna_Shield  [ANT]  164.85 10.41 90 top
C1  12.5pF  [C0402]  102.74 4.83 0 top
C2  12.5pF  [C0402]  80.52 4.83 0 top
C3  TBD  [C0402]  151.51 16.13 0 top
C4  TBD  [C0402]  155.83 16.13 0 top
C5  15pF  [C0402]  118.11 16.13 0 top
C6  15pF  [C0402]  122.43 16.13 0 top
C7  15pF  [C0402]  53.85 4.83 0 top
C8  15pF  [C0402]  58.17 4.83 0 top
C9  1uF  [C0402]  0.51 16.13 0 top
C10  0.1uF  [C0402]  23.5 4.44 90 top
C16  4.7uF  [C0603]  360.43 23.49 90 top
C17  0.1uF  [C0402]  0.13 37.46 90 top
C20  4.7uF  [C0603]  326.39 23.49 90 top
C22  10uF  [C0805]  10.67 14.6 90 top
C23  0.1uF  [C0402]  16.13 15.75 90 top
C24  0.1uF  [C0402]  21.97 15.75 90 top
C25  0.1uF  [C0402]  27.81 15.75 90 top
C26  0.1uF  [C0402]  33.66 15.75 90 top
C27  1uF  [C0402]  39.5 15.75 90 top
C28  10nF  [C0402]  45.34 15.75 90 top
C29  10uF  [C0805]  51.56 14.6 90 top
C30  0.1uF  [C0402]  57.02 15.75 90 top
C35  4.7uF  [C0603]  269.62 23.49 90 top
C36  1uF  [C0402]  258.19 24 90 top
C40  1uF  [C0402]  243.71 24 90 top
C41  4.7uF  [C0603]  166.88 24.13 0 top
C42  22pF  [C0402]  194.56 24 90 top
C43  10uF  [C0805]  171.7 22.86 90 top
C44  1uF  [C0402]  177.04 24 90 top
C45  0.1uF  [C0402]  182.88 24 90 top
C46  10uF  [C0805]  115.95 22.86 90 top
C47  1uF  [C0402]  127.25 24 90 top
C48  0.1uF  [C0402]  133.1 24 90 top
C49  4.7uF  [C0603]  109.98 23.49 90 top
C50  1uF  [C0402]  0.13 24 90 top
C51  1uF  [C0402]  5.97 24 90 top
C52  0.1uF  [C0402]  34.16 37.46 90 top
C53  0.1uF  [C0402]  17.15 24 90 top
C54  0.1uF  [C0402]  22.99 24 90 top
C55  0.1uF  [C0402]  28.83 24 90 top
C56  10uF  [C0805]  35.05 22.86 90 top
C57  0.1uF  [C0402]  40.51 24 90 top
C58  10uF  [C0805]  46.74 22.86 90 top
C59  0.1uF  [C0402]  52.2 24 90 top
C60  1uF  [C0402]  5.97 4.44 90 top
C61  1uF  [C0402]  58.04 24 90 top
C62  1uF  [C0402]  63.37 24 90 top
C63  1uF  [C0402]  69.22 24 90 top
C64  1uF  [C0402]  75.06 24 90 top
C65  0.1uF  [C0402]  80.9 24 90 top
C68  1uF  [C0402]  286.26 24 90 top
C69  0.1uF  [C0402]  292.1 24 90 top
C70  0.1uF  [C0402]  297.94 24 90 top
C71  0.1uF  [C0402]  303.78 24 90 top
C72  0.1uF  [C0402]  309.12 24 90 top
C73  4.7uF  [C0603]  215.01 23.49 90 top
C74  0.1uF  [C0402]  220.6 24 90 top
C75  10nF  [C0402]  226.44 24 90 top
C76  0.1uF  [C0402]  62.87 15.75 90 top
C80  1uF  [C0402]  86.74 24 90 top
C81  0.1uF  [C0402]  92.58 24 90 top
C82  10nF  [C0402]  97.92 24 90 top
C83  4.7uF  [C0603]  366.01 23.49 90 top
C84  4.7uF  [C0603]  275.46 23.49 90 top
C87  0.1uF  [C0402]  132.46 37.46 90 top
C88  0.1uF  [C0402]  79.63 37.46 90 top
C89  0.1uF  [C0402]  67.95 37.46 90 top
C90  0.1uF  [C0402]  40.01 37.46 90 top
C91  0.1uF  [C0402]  62.61 37.46 90 top
C92  0.1uF  [C0402]  85.47 37.46 90 top
C97  0.1uF  [C0402]  11.3 24 90 top
D1  1N5819  [SOD-323_L1.8-W1.3-LS2.5-RD]  377.19 24.13 0 top
D5  KLXES15AAA1  [D0402-BI]  254.51 24.38 0 top
D6  KLXES15AAA1  [D0402-BI]  250.19 24.38 0 top
D7  PSM712  [SOT-23-3_L3.0-W1.7-P0.95-LS2.9-BR]  105.16 36.83 0 top
D10  RB521S  [SOD-523_L1.2-W0.8-LS1.6-RD]  28.58 37.34 90 top
D11  PESD2CAN  [SOT-23-3_L3.0-W1.7-P0.95-LS2.9-BR]  146.18 36.83 0 top
J3  MIPI  [FPC-SMD_30P-P0.50_XUNPU_FPC-05F-30PH20]  95.89 52.58 90 top
J4  Conn_02x05_Odd_Even  [HDR-TH_10P-P2.54-H-M-R2-C5-S2.54-N]  107.95 60.45 0 top
J10  Conn_01x04  [HDR-TH_4P-P2.54-H-M-W10.4]  26.16 61.59 0 top
L1  TBD  [L0603]  160.66 16 0 top
L2  10uH  [L0603]  372.62 24.26 0 top
L4  120R/2A  [L0603]  69.72 16 0 top
L7  2.2uH  [IND-SMD_L2.5-W2.0_MHCHL2520]  205.74 23.75 0 top
L8  2.2uH  [IND-SMD_L2.5-W2.0_MHCHL2520]  145.67 23.75 0 top
L9  120R/2A  [L0603]  201.42 24.26 0 top
L13  100R  [LED0402-RD]  238.12 23.88 90 top
Q4  2SK3018  [SOT-23-3_L2.9-W1.6-P1.90-LS2.8-BR]  122.81 36.83 0 top
Q5  2SK3018  [SOT-23-3_L2.9-W1.6-P1.90-LS2.8-BR]  117.86 36.83 0 top
Q8  S9014  [SOT-23-3_L2.9-W1.6-P1.90-LS2.8-BR]  52.96 36.83 0 top
R1  0R  [R0402]  99.06 4.83 0 top
R2  10M  [R0402]  89.28 4.83 0 top
R3  0R  [R0402]  76.33 4.83 0 top
R4  4.02K  [R0402]  84.96 4.83 0 top
R5  0R  [R0402]  138.56 16.13 0 top
R6  0R  [R0402]  142.88 16.13 0 top
R7  0R  [R0402]  67.69 4.83 0 top
R8  0R  [R0402]  72.01 4.83 0 top
R9  0R  [R0402]  147.19 16.13 0 top
R10  499R  [R0402]  126.37 15.62 90 top
R11  4.02K  [R0402]  62.1 4.32 90 top
R12  5.1K  [R0402]  78.61 15.62 90 top
R13  5.1K  [R0402]  84.2 15.62 90 top
R14  5.1K  [R0402]  89.79 15.62 90 top
R15  5.1K  [R0402]  95.38 15.62 90 top
R16  5.1K  [R0402]  100.97 15.62 90 top
R17  5.1K  [R0402]  106.55 15.62 90 top
R18  10K  [R0402]  112.14 15.62 90 top
R19  10K  [R0402]  73.03 15.62 90 top
R20  0R  [R0402]  4.45 15.62 90 top
R22  4.7K  [R0402]  73.79 37.34 90 top
R23  1K  [R0402]  98.17 37.34 90 top
R24  10K  [R0402]  35.69 4.32 90 top
R25  120R  [R0402]  45.85 37.34 90 top
R26  10K  [R0402]  56.77 37.34 90 top
R33  0R  [R0402]  17.65 4.32 90 top
R34  10K  [R0402]  41.53 4.32 90 top
R36  4.7K  [R0402]  22.73 37.34 90 top
R38  NC  [R0402]  349.5 23.88 90 top
R40  NC  [R0402]  331.98 23.88 90 top
R43  10R  [R0805]  338.2 23.11 90 top
R44  10R  [R0805]  320.68 23.11 90 top
R51  10K  [R0402]  264.03 23.88 90 top
R55  10K  [R0402]  138.94 23.88 90 top
R56  470K  [R0402]  188.72 23.88 90 top
R57  100K  [R0402]  121.41 23.88 90 top
R58  470K  [R0402]  160.02 23.88 90 top
R59  22K  [R0402]  103.76 23.88 90 top
R75  10K  [R0402]  150.11 37.34 90 top
R76  10K  [R0402]  156.08 37.34 90 top
R77  10K  [R0402]  161.93 37.34 90 top
R78  10K  [R0402]  167.77 37.34 90 top
R79  10K  [R0402]  126.62 37.34 90 top
R80  4.7K  [R0402]  16.89 37.34 90 top
R81  4.7K  [R0402]  5.72 37.34 90 top
R82  4.7K  [R0402]  11.05 37.34 90 top
R85  4.7K  [R0402]  11.81 4.32 90 top
R86  4.7K  [R0402]  0.13 4.32 90 top
TP1  TP13  [Test-Point-1*1mm]  314.83 24.51 90 top
TP3  TP13  [Test-Point-1*1mm]  154.18 24.51 90 top
TP4  TP13  [Test-Point-1*1mm]  232.16 24.51 90 top
TP5  TP13  [Test-Point-1*1mm]  380.75 24.51 90 top
TP6  TP13  [Test-Point-1*1mm]  343.54 24.51 90 top
TP8  TP8  [Test-Point-1*1mm]  88.27 62.1 90 top
TP9  TP9  [Test-Point-1*1mm]  82.42 62.1 90 top
TP10  TP10  [Test-Point-1*1mm]  75.31 62.1 90 top
TP11  TP11  [Test-Point-1*1mm]  68.71 62.1 90 top
TP12  TP12  [Test-Point-1*1mm]  61.6 62.1 90 top
TP13  TP13  [Test-Point-1*1mm]  54.48 62.1 90 top
TP14  TP14  [Test-Point-1*1mm]  47.37 62.1 90 top
TP15  TP15  [Test-Point-1*1mm]  40.26 62.1 90 top
TP16  TP16  [Test-Point-1*1mm]  33.15 62.1 90 top
TP17  TP17  [Test-Point-1*1mm]  14.22 62.1 90 top
TP18  TP18  [Test-Point-1*1mm]  7.11 62.1 90 top
TP19  TP19  [Test-Point-1*1mm]  0 62.1 90 top
U1  ESP32-P4NRW32  [QFN-104_L10.0-W10.0-P0.35-TL-EP7.5]  111.76 0 0 top
U3  ZD25Q128DWIGR  [WSON-8_L6.0-W5.0-P1.27-BL-EP]  31.12 1.65 0 top
U4  MAX3485  [SOIC-8_L4.9-W3.9-P1.27-LS6.0-BL]  93.73 34.67 0 top
U6  SY7201ABC  [SOT-23-6_L2.9-W1.6-P0.95-LS2.8-BL]  356.74 23.11 0 top
U9  ME6212C28M5G  [SOT-23-5_L3.0-W1.7-P0.95-LS2.8-BR]  282.45 23.37 0 top
U10  TLV62569  [SOT-23-5_L3.0-W1.7-P0.95-LS2.8-BR]  210.44 23.37 0 top
U11  TLV62569  [SOT-23-5_L3.0-W1.7-P0.95-LS2.8-BR]  150.37 23.37 0 top
U13  TJA1044T/1Z  [SOIC-8_L4.9-W3.9-P1.27-LS6.0-BL]  140.59 34.67 0 top
U14  HD3221ECA  [SSOP-16_L6.2-W5.3-P0.65-LS7.8-BL]  111.51 33.78 0 top
Y1  32.768KHz  [CRYSTAL-SMD_L3.2-W1.5-1]  94.62 4.19 0 top
Y2  40MHz  [OSC-SMD_4P-L3.2-W2.5-BL_SIT8008BI]  134.11 14.86 0 top
Y3  40MHz  [OSC-SMD_4P-L3.2-W2.5-BL_SIT8008BI]  49.4 3.56 0 top

## Footprints (pads in the part's own frame, mm; a bottom-side part is the same pattern mirrored in y, then rotated)
ANT
  rect 1.225x2.65 smd: 1(0,0) 2(5.5,0)
C0402
  rect 0.5x0.54 smd: 1(-0.42,0) 2(0.42,0)
C0603
  rect 0.8x0.9 smd: 1(-0.7,0) 2(0.7,0)
C0805
  rect 1.41x1.35 smd: 1(-1,0) 2(1,0)
CRYSTAL-SMD_L3.2-W1.5-1
  rect 1.05x1.7 smd: 1(-1.275,0) 2(1.275,0)
D0402-BI
  rect 0.6x0.6 smd: 1(-0.5,0) 2(0.5,0)
FPC-SMD_30P-P0.50_XUNPU_FPC-05F-30PH20
  rect 0.3x1.25 smd: 1(-7.25,1.538) 2(-6.75,1.538) 3(-6.25,1.538) 4(-5.75,1.538) 5(-5.25,1.538) 6(-4.75,1.538) 7(-4.25,1.538) 8(-3.75,1.538) 9(-3.25,1.538) 10(-2.75,1.538) 11(-2.25,1.538) 12(-1.75,1.538) 13(-1.25,1.538) 14(-0.75,1.538) 15(-0.25,1.538) 16(0.25,1.538) 17(0.75,1.538) 18(1.25,1.538) 19(1.75,1.538) 20(2.25,1.538) 21(2.75,1.538) 22(3.25,1.538) 23(3.75,1.538) 24(4.25,1.538) 25(4.75,1.538) 26(5.25,1.538) 27(5.75,1.538) 28(6.25,1.538) 29(6.75,1.538) 30(7.25,1.538)
  rect 2x2.5 smd: 31(8.94,-1.538) 32(-8.94,-1.538)
HDR-TH_4P-P2.54-H-M-W10.4
  rect 1.8x1.8 hole 1.1: 1(-3.81,0)
  round 1.8 hole 1.1: 2(-1.27,0) 3(1.27,0) 4(3.81,0)
HDR-TH_10P-P2.54-H-M-R2-C5-S2.54-N
  rect 1.524x1.524 hole 1.1: 1(-5.08,-1.27)
  round 1.524 hole 1.1: 2(-5.08,1.27) 3(-2.54,-1.27) 4(-2.54,1.27) 5(0,-1.27) 6(0,1.27) 7(2.54,-1.27) 8(2.54,1.27) 9(5.08,-1.27) 10(5.08,1.27)
IND-SMD_L2.5-W2.0_MHCHL2520
  rect 0.8x2.2 smd: 1(-1,0) 2(1,0)
L0603
  rect 0.8x0.864 smd: 1(-0.7,0) 2(0.7,0)
LED0402-RD
  rect 0.5x0.54 smd: 1(-0.425,0) 2(0.425,0)
OSC-SMD_4P-L3.2-W2.5-BL_SIT8008BI
  rect 1.4x1.2 smd: 1(-1.1,-0.95) 2(1.1,-0.95) 3(1.1,0.95) 4(-1.1,0.95)
QFN-104_L10.0-W10.0-P0.35-TL-EP7.5
  rect 0.65x0.15 smd: 1(-5,4.375) 2(-5,4.025) 3(-5,3.675) 4(-5,3.325) 5(-5,2.975) 6(-5,2.625) 7(-5,2.275) 8(-5,1.925) 9(-5,1.575) 10(-5,1.225) 11(-5,0.875) 12(-5,0.525) 13(-5,0.175) 14(-5,-0.175) 15(-5,-0.525) 16(-5,-0.875) 17(-5,-1.225) 18(-5,-1.575) 19(-5,-1.925) 20(-5,-2.275) 21(-5,-2.625) 22(-5,-2.975) 23(-5,-3.325) 24(-5,-3.675) 25(-5,-4.025) 26(-5,-4.375) 53(5,-4.375) 54(5,-4.025) 55(5,-3.675) 56(5,-3.325) 57(5,-2.975) 58(5,-2.625) 59(5,-2.275) 60(5,-1.925) 61(5,-1.575) 62(5,-1.225) 63(5,-0.875) 64(5,-0.525) 65(5,-0.175) 66(5,0.175) 67(5,0.525) 68(5,0.875) 69(5,1.225) 70(5,1.575) 71(5,1.925) 72(5,2.275) 73(5,2.625) 74(5,2.975) 75(5,3.325) 76(5,3.675) 77(5,4.025) 78(5,4.375)
  rect 0.15x0.65 smd: 27(-4.375,-5) 28(-4.025,-5) 29(-3.675,-5) 30(-3.325,-5) 31(-2.975,-5) 32(-2.625,-5) 33(-2.275,-5) 34(-1.925,-5) 35(-1.575,-5) 36(-1.225,-5) 37(-0.875,-5) 38(-0.525,-5) 39(-0.175,-5) 40(0.175,-5) 41(0.525,-5) 42(0.875,-5) 43(1.225,-5) 44(1.575,-5) 45(1.925,-5) 46(2.275,-5) 47(2.625,-5) 48(2.975,-5) 49(3.325,-5) 50(3.675,-5) 51(4.025,-5) 52(4.375,-5) 79(4.375,5) 80(4.025,5) 81(3.675,5) 82(3.325,5) 83(2.975,5) 84(2.625,5) 85(2.275,5) 86(1.925,5) 87(1.575,5) 88(1.225,5) 89(0.875,5) 90(0.525,5) 91(0.175,5) 92(-0.175,5) 93(-0.525,5) 94(-0.875,5) 95(-1.225,5) 96(-1.575,5) 97(-1.925,5) 98(-2.275,5) 99(-2.625,5) 100(-2.975,5) 101(-3.325,5) 102(-3.675,5) 103(-4.025,5) 104(-4.375,5)
  rect 7.5x7.5 smd: 105(0,0)
R0402
  rect 0.566x0.54 smd: 1(-0.433,0) 2(0.433,0)
R0805
  rect 1.133x1.377 smd: 1(-1,0) 2(1,0)
SOD-323_L1.8-W1.3-LS2.5-RD
  rect 1x0.75 smd: 1(-1.173,0) 2(1.173,0)
SOD-523_L1.2-W0.8-LS1.6-RD
  rect 0.6x0.36 smd: 1(-0.65,0) 2(0.65,0)
SOIC-8_L4.9-W3.9-P1.27-LS6.0-BL
  oval 0.588x2.045 smd: 1(-1.905,-2.57) 2(-0.635,-2.57) 3(0.635,-2.57) 4(1.905,-2.57) 5(1.905,2.57) 6(0.635,2.57) 7(-0.635,2.57) 8(-1.905,2.57)
SOT-23-3_L2.9-W1.6-P1.90-LS2.8-BR
  rect 1.07x0.6 smd: 1(1.235,-0.95) 2(1.235,0.95) 3(-1.235,0)
SOT-23-3_L3.0-W1.7-P0.95-LS2.9-BR
  rect 1.038x0.532 smd: 1(1.101,-0.95) 2(1.101,0.95) 3(-1.101,0)
SOT-23-5_L3.0-W1.7-P0.95-LS2.8-BR
  rect 1.1x0.6 smd: 1(1.3,-0.95) 2(1.3,0) 3(1.3,0.95) 4(-1.3,0.95) 5(-1.3,-0.95)
SOT-23-6_L2.9-W1.6-P0.95-LS2.8-BL
  rect 0.532x1.072 smd: 1(-0.95,-1.149) 2(0,-1.149) 3(0.95,-1.149) 4(0.95,1.149) 5(0,1.149) 6(-0.95,1.149)
SSOP-16_L6.2-W5.3-P0.65-LS7.8-BL
  oval 0.4x2.1 smd: 1(-2.275,-3.45) 2(-1.625,-3.45) 3(-0.975,-3.45) 4(-0.325,-3.45) 5(0.325,-3.45) 6(0.975,-3.45) 7(1.625,-3.45) 8(2.275,-3.45) 9(2.275,3.45) 10(1.625,3.45) 11(0.975,3.45) 12(0.325,3.45) 13(-0.325,3.45) 14(-0.975,3.45) 15(-1.625,3.45) 16(-2.275,3.45)
Test-Point-1*1mm
  round 1 smd: 1(0,0)
WSON-8_L6.0-W5.0-P1.27-BL-EP
  oval 0.581x1.276 smd: 1(-1.905,-3.013) 2(-0.635,-3.013) 3(0.635,-3.013) 4(1.905,-3.013) 5(1.905,3.013) 6(0.635,3.013) 7(-0.635,3.013) 8(-1.905,3.013)
  rect 3.81x2.638 smd: 9(0,0)

## Nets
As in the schematic.

Pads without a net: D5 1 2; D6 1 2; J3 19 20 22 23 30; L13 1 2; U1 3 6 7 13 14 15 16 17 18 19 20 22 23 24 42 43 44 50 65 88 89 90 92 93 94 95 97 98; U3 9; U9 4; U13 5; U14 10
